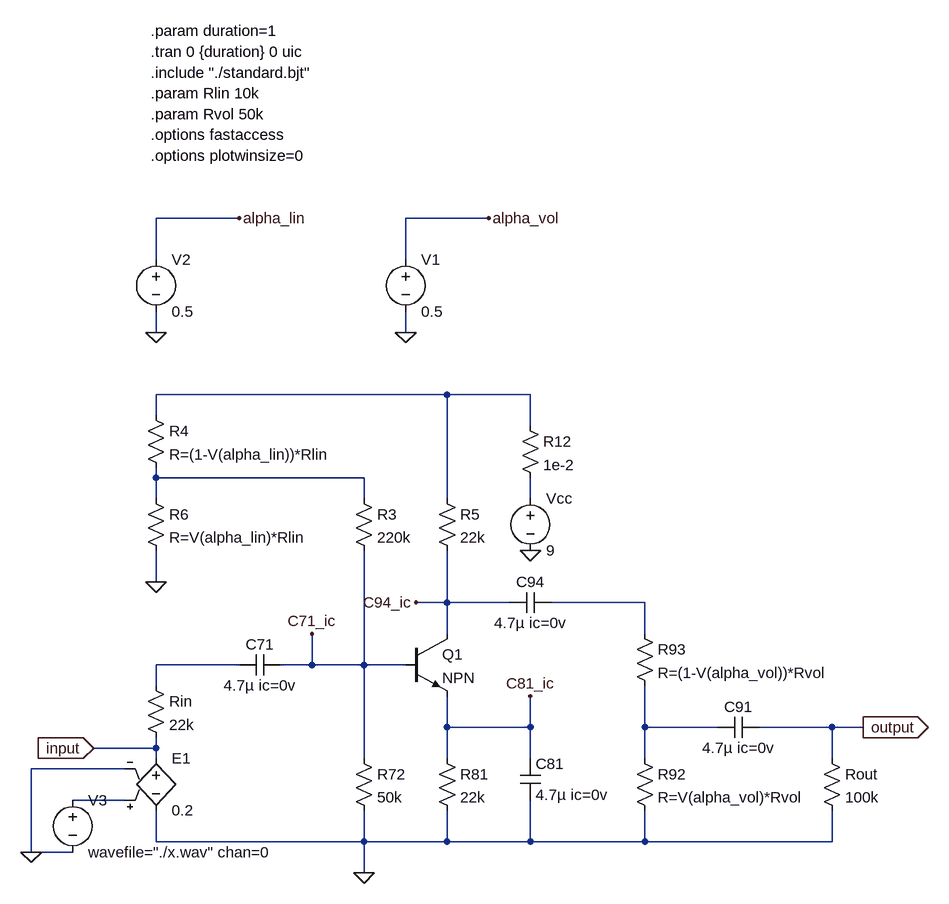
[diagram p0: schematic Fuzz Test.asc]
Fuzz Test.asc, the LTspice schematic file:
Version 4
SHEET 1 3724 884
WIRE 832 -1056 704 -1056
WIRE 1216 -1056 1088 -1056
WIRE 704 -992 704 -1056
WIRE 1088 -992 1088 -1056
WIRE 704 -880 704 -912
WIRE 1088 -880 1088 -912
WIRE 1152 -784 704 -784
WIRE 1280 -784 1152 -784
WIRE 704 -752 704 -784
WIRE 1280 -736 1280 -784
WIRE 704 -656 704 -672
WIRE 1024 -656 704 -656
WIRE 704 -624 704 -656
WIRE 1024 -624 1024 -656
WIRE 1152 -624 1152 -784
WIRE 1280 -624 1280 -656
WIRE 704 -496 704 -544
WIRE 1152 -464 1152 -544
WIRE 1152 -464 1104 -464
WIRE 1248 -464 1152 -464
WIRE 1456 -464 1312 -464
WIRE 1152 -416 1152 -464
WIRE 1456 -416 1456 -464
WIRE 832 -368 704 -368
WIRE 944 -368 944 -416
WIRE 944 -368 896 -368
WIRE 1024 -368 1024 -544
WIRE 1024 -368 944 -368
WIRE 1088 -368 1024 -368
WIRE 704 -336 704 -368
WIRE 1152 -272 1152 -320
WIRE 1280 -272 1280 -320
WIRE 1280 -272 1152 -272
WIRE 1456 -272 1456 -336
WIRE 1568 -272 1456 -272
WIRE 1744 -272 1632 -272
WIRE 1792 -272 1744 -272
WIRE 704 -240 704 -256
WIRE 704 -240 608 -240
WIRE 704 -224 704 -240
WIRE 1024 -224 1024 -368
WIRE 1152 -224 1152 -272
WIRE 1280 -224 1280 -272
WIRE 1456 -224 1456 -272
WIRE 1744 -224 1744 -272
WIRE 656 -208 512 -208
WIRE 656 -160 576 -160
WIRE 704 -96 704 -144
WIRE 1024 -96 1024 -144
WIRE 1024 -96 704 -96
WIRE 1152 -96 1152 -144
WIRE 1152 -96 1024 -96
WIRE 1280 -96 1280 -160
WIRE 1280 -96 1152 -96
WIRE 1456 -96 1456 -144
WIRE 1456 -96 1280 -96
WIRE 1744 -96 1744 -144
WIRE 1744 -96 1456 -96
WIRE 512 -80 512 -208
WIRE 576 -80 512 -80
WIRE 1024 -48 1024 -96
FLAG 1280 -544 0
FLAG 1024 -48 0
FLAG 704 -496 0
FLAG 704 -880 0
FLAG 832 -1056 alpha_lin
FLAG 608 -240 input
IOPIN 608 -240 In
FLAG 1088 -880 0
FLAG 1216 -1056 alpha_vol
FLAG 1792 -272 output
IOPIN 1792 -272 Out
FLAG 944 -416 C71_ic
FLAG 1280 -320 C81_ic
FLAG 1104 -464 C94_ic
FLAG 512 -80 0
SYMBOL res 1136 -640 R0
SYMATTR InstName R5
SYMATTR Value 22k
SYMBOL res 1008 -640 R0
SYMATTR InstName R3
SYMATTR Value 220k
SYMBOL voltage 1280 -640 R0
WINDOW 123 0 0 Left 0
WINDOW 39 0 0 Left 0
SYMATTR InstName Vcc
SYMATTR Value 9
SYMBOL res 1136 -240 R0
SYMATTR InstName R81
SYMATTR Value 22k
SYMBOL res 1440 -240 R0
SYMATTR InstName R92
SYMATTR Value R=V(alpha_vol)*Rvol
SYMBOL res 1008 -240 R0
SYMATTR InstName R72
SYMATTR Value 50k
SYMBOL res 1728 -240 R0
SYMATTR InstName Rout
SYMATTR Value 100k
SYMBOL res 1440 -432 R0
SYMATTR InstName R93
SYMATTR Value R=(1-V(alpha_vol))*Rvol
SYMBOL res 688 -768 R0
SYMATTR InstName R4
SYMATTR Value R=(1-V(alpha_lin))*Rlin
SYMBOL res 688 -640 R0
SYMATTR InstName R6
SYMATTR Value R=V(alpha_lin)*Rlin
SYMBOL voltage 704 -1008 R0
WINDOW 123 0 0 Left 0
WINDOW 39 0 0 Left 0
SYMATTR InstName V2
SYMATTR Value 0.5
SYMBOL res 688 -352 R0
SYMATTR InstName Rin
SYMATTR Value 22k
SYMBOL cap 896 -384 R90
WINDOW 0 0 32 VBottom 2
WINDOW 3 32 32 VTop 2
SYMATTR InstName C71
SYMATTR Value 4.7µ ic=0v
SYMBOL cap 1312 -480 R90
WINDOW 0 0 32 VBottom 2
WINDOW 3 32 32 VTop 2
SYMATTR InstName C94
SYMATTR Value 4.7µ ic=0v
SYMBOL cap 1264 -224 R0
SYMATTR InstName C81
SYMATTR Value 4.7µ ic=0v
SYMBOL cap 1632 -288 R90
WINDOW 0 0 32 VBottom 2
WINDOW 3 32 32 VTop 2
SYMATTR InstName C91
SYMATTR Value 4.7µ ic=0v
SYMBOL res 1264 -752 R0
SYMATTR InstName R12
SYMATTR Value 1e-2
SYMBOL voltage 1088 -1008 R0
WINDOW 123 0 0 Left 0
WINDOW 39 0 0 Left 0
SYMATTR InstName V1
SYMATTR Value 0.5
SYMBOL npn 1088 -416 R0
SYMATTR InstName Q1
SYMBOL e2 704 -240 R0
SYMATTR InstName E1
SYMATTR Value 0.2
SYMBOL voltage 576 -176 R0
SYMATTR InstName V3
SYMATTR Value wavefile="./x.wav" chan=0
TEXT 696 -1312 Left 2 !.tran 0 {duration} 0 uic
TEXT 696 -1248 Left 2 !.param Rlin 10k
TEXT 696 -1280 Left 2 !.include "./standard.bjt"
TEXT 696 -1216 Left 2 !.param Rvol 50k
TEXT 696 -1184 Left 2 !.options fastaccess
TEXT 696 -1152 Left 2 !.options plotwinsize=0
TEXT 696 -1344 Left 2 !.param duration=1

The netlist it stands for:
* Fuzz Test.asc
R5 N001 C94_ic 22k
R3 N002 C71_ic 220k
Vcc N003 0 9
R81 C81_ic 0 22k
R92 N006 0 R=V(alpha_vol)*Rvol
R72 C71_ic 0 50k
Rout output 0 100k
R93 N004 N006 R=(1-V(alpha_vol))*Rvol
R4 N001 N002 R=(1-V(alpha_lin))*Rlin
R6 N002 0 R=V(alpha_lin)*Rlin
V2 alpha_lin 0 0.5
Rin N005 input 22k
C71 C71_ic N005 4.7µ ic=0v
C94 N004 C94_ic 4.7µ ic=0v
C81 C81_ic 0 4.7µ ic=0v
C91 output N006 4.7µ ic=0v
R12 N001 N003 1e-2
V1 alpha_vol 0 0.5
Q1 C94_ic C71_ic C81_ic 0 NPN
E1 input 0 N007 0 0.2
V3 N007 0 wavefile="./x.wav" chan=0
.model NPN NPN
.model PNP PNP
.lib standard.bjt
.tran 0 {duration} 0 uic
.param Rlin 10k
.include "./standard.bjt"
.param Rvol 50k
.options fastaccess
.options plotwinsize=0
.param duration=1
.backanno
.end